# Altium schematic sheet MD029A_DRV8300.SchDoc
size Letter; Date: Not shown in title block; ApprovedBy: Not shown in title block; CheckedBy: Not shown in title block; Author: Not shown in title block; CompanyName: Not shown in title block; Engineer: Not shown in title block; Organization: Not shown in title block; Address1: Not shown in title block; Address2: Not shown in title block; Address3: Not shown in title block; Address4: Not shown in title block; DocumentNumber: 1; Revision: Use project parameter SCH_Rev; SheetNumber: 1; SheetTotal: 5; PageSetup: Record=PageOptions|CenterHorizontal=True|CenterVertical=True|PrintScale=1.00|XCorrection=1.00|YCorrection=1.00|PrintKind=0|BorderSize=5000000|LeftOffset=0|BottomOffset=0|Orientation=2|PaperLength=1000|PaperWidth=1000|Scale=100|PaperSource=15|PrintQuality=600|MediaType=1|DitherType=10|PaperKind=Letter|PrintScaleMode=1; CurrentTime: Not shown in title block; CurrentDate: Not shown in title block; Time: Not shown in title block; DocumentFullPathAndName: Not shown in title block; DocumentName: Not shown in title block; ModifiedDate: Not shown in title block; ImagePath: Not shown in title block
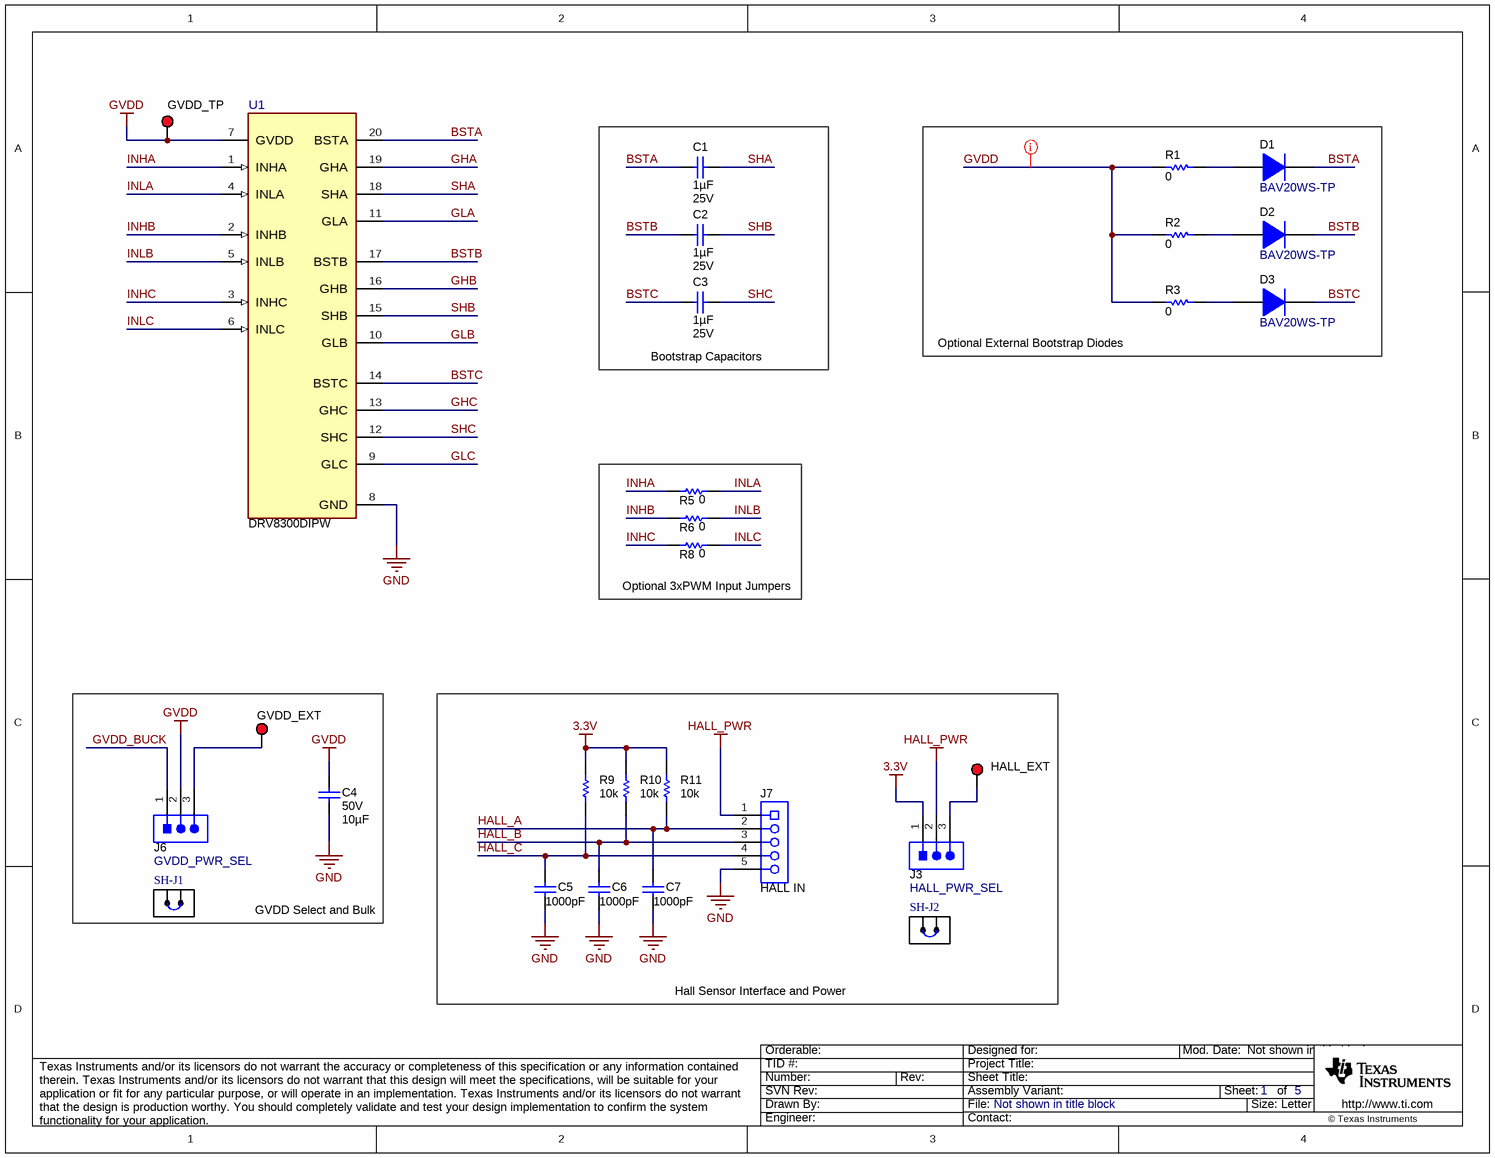
[diagram p0: MD029A_DRV8300.SchDoc]

## Parts
C1  Cap_F: 1µF  VDC_V: 25V  [0805L]  (hidden comment: CL21B105KAFNNNE)
C2  Cap_F: 1µF  VDC_V: 25V  [0805L]  (hidden comment: CL21B105KAFNNNE)
C3  Cap_F: 1µF  VDC_V: 25V  [0805L]  (hidden comment: CL21B105KAFNNNE)
C4  VDC_V: 50V  ValueDisplayed: 10µF  [1210_270L]  (hidden comment: CL32B106KBJNNWE)
C5  ValueDisplayed: 1000pF  [0603L]  (hidden comment: 885012206034)
C6  ValueDisplayed: 1000pF  [0603L]  (hidden comment: 885012206034)
C7  ValueDisplayed: 1000pF  [0603L]  (hidden comment: 885012206034)
D1  BAV20WS-TP  [SOD-323]
D2  BAV20WS-TP  [SOD-323]
D3  BAV20WS-TP  [SOD-323]
GVDD_EXT  (no value)  [Keystone5000]
GVDD_TP  (no value)  [Keystone5000]
HALL_EXT  (no value)  [Keystone5000]
J3  HALL_PWR_SEL  [WURTH_61300311121]
J6  GVDD_PWR_SEL  [WURTH_61300311121]
J7  HALL IN  [Phoenix_1792892]
R1  ValueDisplayed: 0  [0805L]  (hidden comment: CRCW08050000Z0EAHP)
R2  ValueDisplayed: 0  [0805L]  (hidden comment: CRCW08050000Z0EAHP)
R3  ValueDisplayed: 0  [0805L]  (hidden comment: CRCW08050000Z0EAHP)
R5  value 0  [0603L]  (hidden comment: CRCW06030000Z0EA)
R6  value 0  [0603L]  (hidden comment: CRCW06030000Z0EA)
R8  value 0  [0603L]  (hidden comment: CRCW06030000Z0EA)
R9  value 10k  [0603L]  (hidden comment: CRCW060310K0JNEA)
R10  value 10k  [0603L]  (hidden comment: CRCW060310K0JNEA)
R11  value 10k  [0603L]  (hidden comment: CRCW060310K0JNEA)
SH-J1  SNT-100-BK-G  [SNT-100-BK-G]  (value not drawn)
SH-J2  SNT-100-BK-G  [SNT-100-BK-G]  (value not drawn)
U1  DRV8300DIPW  [PW0020A-MFG]

## Blocks framed on the sheet
Bootstrap Capacitors: C1-C3
Optional External Bootstrap Diodes: D1-D3 R1-R3
Optional 3xPWM Input Jumpers: R5 R6 R8
GVDD Select and Bulk: C4 GVDD_EXT J6 SH-J1
Hall Sensor Interface and Power: C5-C7 HALL_EXT J3 J7 R9-R11 SH-J2

## Nets
3.3V: J3.1 R9.1 R10.1 R11.1
GND: C4.2 C5.2 C6.2 C7.2 J7.5 U1.8(GND)
GVDD: C4.1 GVDD_TP.1 J6.2 R1.2 R2.2 R3.2 U1.7(GVDD)
HALL_PWR: J3.2 J7.1
BSTA: C1.2 D1.1(K) U1.20(BSTA)
BSTB: C2.2 D2.1(K) U1.17(BSTB)
BSTC: C3.2 D3.1(K) U1.14(BSTC)
GHA: U1.19(GHA)
GHB: U1.16(GHB)
GHC: U1.13(GHC)
GLA: U1.11(GLA)
GLB: U1.10(GLB)
GLC: U1.9(GLC)
GVDD_BUCK: J6.1
HALL_A: C7.1 J7.2 R11.2
HALL_B: C6.1 J7.3 R10.2
HALL_C: C5.1 J7.4 R9.2
INHA: R5.2 U1.1(INHA)
INHB: R6.2 U1.2(INHB)
INHC: R8.2 U1.3(INHC)
INLA: R5.1 U1.4(INLA)
INLB: R6.1 U1.5(INLB)
INLC: R8.1 U1.6(INLC)
SHA: C1.1 U1.18(SHA)
SHB: C2.1 U1.15(SHB)
SHC: C3.1 U1.12(SHC)
NetD1_2: D1.2(A) R1.1
NetD2_2: D2.2(A) R2.1
NetD3_2: D3.2(A) R3.1
NetGVDD_EXT_1: GVDD_EXT.1 J6.3
NetHALL_EXT_1: HALL_EXT.1 J3.3

## Layout directives
net class 2.5A: GVDD

## Notes on the sheet
- Drawn By:
- SVN Rev:
- Number:
- TID #:
- Orderable:
- Rev:
- Sheet Title:
- File:
- Project Title:
- Designed for:
- Assembly Variant:
- Mod. Date:
- Sheet:
- Size:
- of
- Letter
- http://www.ti.com
- Texas Instruments and/or its licensors do not warrant the accuracy or completeness of this specification or any information contained therein. Texas Instruments and/or its licensors do not warrant that this design will meet the specifications, will be suitable for your application or fit for any particular purpose, or will operate in an implementation. Texas Instruments and/or its licensors do not warrant that the design is production worthy. You should completely validate and test your design implementation to confirm the system functionality for your application.
- Engineer:
- Contact:
- © Texas Instruments

## Library data of the parts
C1-C3 = CMP-0083859-1: CAP, CERM, 1 µF, 25 V,+/- 10%, X7R, 0805; Manufacturer: Samsung Electro-Mechanics; TaMin_C: -55°C; Polarized: N; Green_Lifecycle: Active; SizeAreaWB_mm2: 6.75; Green_REACh: Passed; U/M: EA; Value: 1uF; TaMax_C: 125°C; SizeZ_mm: 1.45; SizeX_mm: 2; SizeY_mm: 1.25; Cap_Case: 0805; SizeArea_mm2: 2.5; AEC Category: Q200; ComponentLink1URL: http://www.samsungsem.com/kr/support/product-search/mlcc/CL21B105KAFNNNE.jsp; TempCo: X7R; RoHS: Y; MountType: SMT; Green_EU RoHS-2: Passed; Green_EU RoHS: Passed; PackageReference: 0805; Tolerance_%: 10%; Value2: 25V; CompType: Capacitor; PartNumber: CL21B105KAFNNNE; AEC Qualified: N; ComponentLink1Description: Datasheet link; AEC Grade: N/A; Technology: Ceramic; ValueDisplayed: 1µF
C4 = CMP-0079201-1: CAP, CERM, 10 µF, 50 V,+/- 10%, X7R, 1210; Manufacturer: Samsung Electro-Mechanics; TaMin_C: -55°C; ESR_ohm: 5m; Polarized: N; SizeAreaWB_mm2: 14.7; Value1: 0.005 ohm; U/M: EA; Value: 10uF; TaMax_C: 125°C; SizeZ_mm: 2.7; SizeX_mm: 3.2; SizeY_mm: 2.5; Cap_Case: 1210; SizeArea_mm2: 8; AEC Category: Q200; ComponentLink1URL: http://www.samsungsem.com/kr/support/product-search/mlcc/__icsFiles/afieldfile/2016/08/18/S_CL32B106KBJNNWE.pdf; TempCo: X7R; RoHS: Y; MountType: SMT; Supplier 1: Digi-Key; PackageReference: 1210; Tolerance_%: 10%; Value2: 50V; CompType: Capacitor; PartNumber: CL32B106KBJNNWE; AEC Qualified: N; Cap_F: 10µF; ComponentLink1Description: Datasheet link; AEC Grade: N/A; Supplier Part Number 1: 1276-3388-1-ND; Technology: Ceramic
C5-C7 = CMP-0006826-4: CAP, CERM, 1000 pF, 16 V, +/- 10%, X7R, 0603; Manufacturer: Wurth Elektronik; TaMin_C: -55°C; Polarized: N; SizeAreaWB_mm2: 4.68; Value1: Unknown; U/M: EA; Value: 1000pF; TaMax_C: 125°C; SizeZ_mm: 1; SizeX_mm: 1.6; SizeY_mm: 0.8; Cap_Case: 0603; Value2: 16V; SizeArea_mm2: 1.28; CompType: Capacitor; Cap_F: 1nF; AEC Category: Q200; Publisher: Texas Instruments; TempCo: X7R; Published: 2008-06-19; RoHS: Y; MountType: SMT; Supplier 1: Mouser; PackageReference: 0603; Tolerance_%: 10%; LatestRevisionDate: 2017-03-09; PartNumber: 885012206034; AEC Qualified: N; ComponentLink1Description: Datasheet link; AEC Grade: N/A; Supplier Part Number 1: 710-885012206034; Technology: Ceramic; ComponentLink1URL: http://katalog.we-online.de/pbs/datasheet/885012206034.pdf
D1-D3 = CMP-0029044-2: Diode, P-N, 150 V, 0.2 A, SOD-323; Manufacturer: Micro Commercial Components; Value2: 1.25V; AEC Category: Q101; SizeArea_mm2: 3.645; Vr_V: 150V; Green_REACh: Incomplete; SizeZ_mm: 1; Green_Lifecycle: Not Set; TJmax_C: 150°C; SizeAreaWB_mm2: 8.695; Value1: 0.2A; SizeX_mm: 2.7; Io_A: 200mA; SizeY_mm: 1.35; Value: 150V; PartNumber: BAV20WS-TP; AEC Qualified: ?; ComponentLink1URL: http://www.mccsemi.com/up_pdf/BAV19WS-BAV21WS(SOD-323).PDF; PackageReference: SOD-323; Vf_V: 1.25V; RoHS: Y; CompType: Diode; MountType: SMT; Type: P-N; Green_EU RoHS-2: Incomplete; Green_EU RoHS: Incomplete; ComponentLink1Description: Datasheet link
GVDD_EXT GVDD_TP HALL_EXT = CMP-0055137-1: Test Point, Miniature, Red, TH; PartNumber: 5000; Manufacturer: Keystone; ContactFinish: Silver; CNHeader: FALSE; CT: TRUE; Green_Lifecycle: Active; Green_REACh: Passed; PackageReference: Red Miniature Testpoint; CompType: Test Point; RoHS: Y; MountType: TH; ComponentLink1Description: Datasheet URL; ComponentLink1URL: http://www.keyelco.com/userAssets/file/M60-2p60.pdf; Publisher: Texas Instruments; LatestRevisionDate: 26/05/2017; Supplier 1: Digi-Key; Supplier Part Number 1: 36-5000-ND; Supplier 2: Mouser; Supplier Part Number 2: 534-5000; Color: Red; Green_EU RoHS-2: Incomplete; Green_EU RoHS: Passed
J3 J6 = CMP-0054796-2: Header, 2.54 mm, 3x1, Gold, TH; Manufacturer: Wurth Elektronik; PartNumber: 61300311121; Green_Lifecycle: Active; Green_REACh: Passed; Cert_UL: Y; Gender: Male; Pitch_mm: 2.54; Row_Count: 1; Shrouded: N; ComponentLink1URL: http://katalog.we-online.de/em/datasheet/6130xx11121.pdf; ClassName: Header; Supplier Part Number 2: 20X0950; Supplier 2: Newark; Supplier Part Number 3: 356154; Supplier 3: Farnell; RoHS: Y; MountType: TH; Green_EU RoHS-2: Incomplete; Supplier 1: Digi-Key; Green_EU RoHS: Passed; PackageReference: Header, 2.54mm, 3x1, TH; CompType: Header; ComponentLink1Description: Datasheet URL; Supplier Part Number 1: 732-5316-ND; Color: Black; ContactFinish: Gold; Orientation: Vertical; PinCount: 3
J7 = CMP-0055532-1: Terminal Block, 5mm, 5x1, R/A, TH; Manufacturer: Phoenix Contact; PartNumber: 1792892; Cert_VDE: Y; CNHeader: FALSE; Current_A: 16A; Gender: Female; Voltage_V: 400V; Row_Count: 1; Pitch_mm: 5; CT: TRUE; ComponentLink1URL: https://www.phoenixcontact.com/online/portal/pi?uri=pxc-oc-itemdetail:pid=1792892&library=pien&pcck=P-11-01-05&tab=1; Supplier Part Number 2: 78T0423; Publisher: Texas Instruments; Supplier 2: Newark; Supplier Part Number 3: 651-1792892; Color: Green; Supplier 3: Mouser; Cert_CULUS: Y; RoHS: Y; MountType: TH; Supplier 1: Digi-Key; PackageReference: Terminal Block, 5mm, 5x1, R/A, TH; PinCount: 5; CompType: Terminal Block; LatestRevisionDate: 26/05/2017; Orientation: R/A; ComponentLink1Description: Datasheet URL; Supplier Part Number 1: 277-2521-ND; Cert_UL: Y
R1-R3 = CMP-0020443-3: RES, 0, 5%, 0.333 W, AEC-Q200 Grade 0, 0805; Manufacturer: Vishay-Dale; Power_W: 333mW; TempCo: 200 ppm/C; Value_Code: 0000; Value: 0; EIA_Code: E24; SizeX_mm: 2; SizeY_mm: 1.25; SizeZ_mm: 1.45; Value2: 0.333W; SizeArea_mm2: 2.5; AEC Qualified: Y; AEC Category: Q200; VDC_V: 150V; Supplier Part Number 2: 68R2993; Supplier 2: Newark; Supplier Part Number 3: 71-CRCW08050000Z0EAH; Supplier 3: Mouser; RoHS: E; Value1: 5%; MountType: SMT; Supplier 1: Digi-Key; PackageReference: 0805; Tolerance_%: 5%; Res_ohm: 0; CompType: Resistor; PartNumber: CRCW08050000Z0EAHP; ComponentLink1Description: Datasheet link; Supplier Part Number 1: 541-0.0TBCT-ND; Technology: Thick Film; ComponentLink1URL: http://www.vishay.com/docs/20043/crcwhpe3.pdf; AEC Grade: 0
R5 R6 R8 = CMP-0025697-4: RES, 0, 5%, 0.1 W, AEC-Q200 Grade 0, 0603; Manufacturer: Vishay-Dale; Value_Code: 0000; Power_W: 100mW; Value2: 0.1W; VDC_V: 75V; TempCo: 200 ppm/C; EIA_Code: E24; AEC Category: Q200; AEC Qualified: Y; SizeArea_mm2: 1.28; SizeX_mm: 1.6; SizeY_mm: 0.8; SizeZ_mm: 1; CompType: Resistor; PartNumber: CRCW06030000Z0EA; PackageReference: 0603; RoHS: E; Res_ohm: 0; Tolerance_%: 5%; Value1: 5%; MountType: SMT; Technology: Thick Film; ComponentLink1Description: Datasheet link; ComponentLink1URL: http://www.vishay.com/docs/20035/dcrcwe3.pdf; Supplier 1: Digi-Key; Supplier Part Number 1: 541-0.0GCT-ND; Supplier 2: Newark; Supplier Part Number 2: 52K8014; Supplier 3: Mouser; Supplier Part Number 3: 71-CRCW0603-0-E3; ValueDisplayed: 0; AEC Grade: 0
R9-R11 = CMP-0025701-4: RES, 10 k, 5%, 0.1 W, AEC-Q200 Grade 0, 0603; Manufacturer: Vishay-Dale; Value_Code: 10k0; Power_W: 100mW; Value2: 0.1W; VDC_V: 75V; TempCo: 200 ppm/C; EIA_Code: E24; AEC Category: Q200; AEC Qualified: Y; AEC Grade: 0; SizeArea_mm2: 1.28; SizeX_mm: 1.6; SizeY_mm: 0.8; SizeZ_mm: 1; CompType: Resistor; PartNumber: CRCW060310K0JNEA; PackageReference: 0603; RoHS: E; Res_ohm: 10k; Tolerance_%: 5%; Value1: 5%; MountType: SMT; Technology: Thick Film; ComponentLink1Description: Datasheet link; ComponentLink1URL: http://www.vishay.com/docs/20035/dcrcwe3.pdf; Supplier 1: Digi-Key; Supplier Part Number 1: 541-10KGCT-ND; Supplier 2: Newark; Supplier Part Number 2: 52K8066; Supplier 3: Mouser; Supplier Part Number 3: 71-CRCW0603J-10K-E3; ValueDisplayed: 10k
SH-J1 SH-J2 = CMP-0003623-3: Shunt, 100mil, Gold plated, Black; Alternate PartNumber: 969102-0000-DA; Manufacturer: Samtec; Alternate Manufacturer: 3M; Value: 1x2; ComponentLink1URL: http://www.samtec.com/ftppub/pdf/SNT.PDF; Supplier 1: Digi-Key; CompType: Shunt; PackageReference: Shunt; ClassName: Shunt; RoHS: Y; Supplier Part Number 1: SAM8858-ND; MountType: N/A; PartNumber: SNT-100-BK-G; ComponentLink1Description: Datasheet Link
U1 = CMP-0089052-1: Three-Phase BLDC Gate Driver; Manufacturer: Texas Instruments; AEC Qualified: No; SizeZ_mm: 1.2mm; Operating Temperature Range: -40°C to +150°C; PartNumber: DRV8300DIPW; RoHS: UNKNOWN; PackageReference: TSSOP20